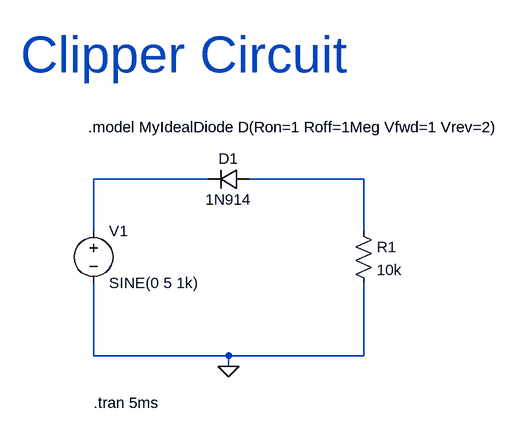
[diagram p0: schematic Clipping.asc]
Clipping.asc, the LTspice schematic file:
Version 4
SHEET 1 1064 680
WIRE 80 -224 -96 -224
WIRE 320 -224 144 -224
WIRE -96 -144 -96 -224
WIRE 320 -144 320 -224
WIRE -96 48 -96 -64
WIRE 112 48 -96 48
WIRE 320 48 320 -64
WIRE 320 48 112 48
WIRE 112 64 112 48
FLAG 112 64 0
SYMBOL diode 144 -240 R90
WINDOW 0 0 32 VBottom 2
WINDOW 3 32 32 VTop 2
SYMATTR InstName D1
SYMATTR Value 1N914
SYMBOL voltage -96 -160 R0
WINDOW 123 0 0 Left 0
WINDOW 39 0 0 Left 0
SYMATTR InstName V1
SYMATTR Value SINE(0 5 1k)
SYMBOL res 304 -160 R0
SYMATTR InstName R1
SYMATTR Value 10k
TEXT -104 -304 Left 2 !.model MyIdealDiode D(Ron=1 Roff=1Meg Vfwd=1 Vrev=2)
TEXT -96 120 Left 2 !.tran 5ms
TEXT -208 -416 Left 6 ;Clipper Circuit

The netlist it stands for:
* Clipping.asc
D1 N002 N001 1N914
V1 N001 0 SINE(0 5 1k)
R1 N002 0 10k
.model D D
.lib standard.dio
.model MyIdealDiode D(Ron=1 Roff=1Meg Vfwd=1 Vrev=2)
.tran 5ms
* Clipper Circuit
.backanno
.end